# Altium schematic sheet NBT_RS232_TESTPLUG.SchDoc
size A4; Organization: Altium Limited; Address1: L3, 12a Rodborough Rd; Address2: Frenchs Forest; Address3: NSW; Address4: Australia 2086; DocumentNumber: 2; SheetNumber: 2; SheetTotal: 3
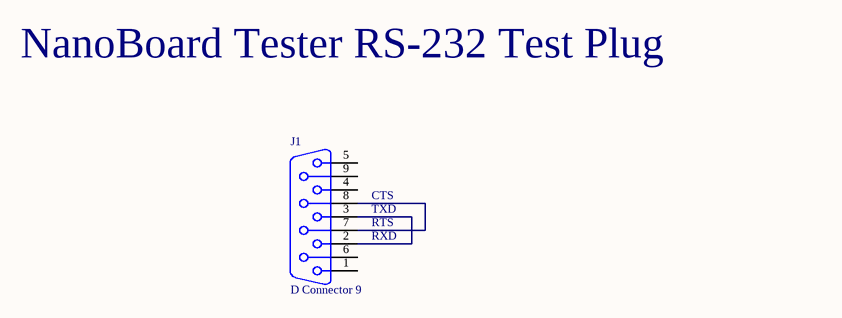
[diagram p0: NBT_RS232_TESTPLUG.SchDoc]

## Parts
J1  D Connector 9  [DSUB1.385-2H9]

## Nets
NetJ1_2: J1.2 J1.3
NetJ1_7: J1.7 J1.8

Not connected (* = marked no-connect by the designer): J1 1 4 5 6 9 10(MH1) 11(MH2)

## Notes on the sheet
- NanoBoard Tester RS-232 Test Plug
- (near J1) TXD
- (near J1) CTS
- (near J1) RXD
- (near J1) RTS
- Title
- Size:
- Date:
- A4
- Number:
- Time:
- Revision:
- Sheet
- of
- File:

## Library data of the parts
J1 = D Connector 9: Receptacle Assembly, 9 Position, Right Angle; Manufacturer: Generic Components; Package Information: Latest Revision: O; Positions: 9; Published: 15-Jun-2001; Revision: July-2002: Re-released for DXP Platform.; Datasheet: (1-Sep-1999); Package Reference: 788750; Publisher: Altium Limited; Class I: Connector; Orientation: Right Angle; Gender: Receptacle